# Altium schematic sheet 1_P1.schdoc
size 309 x 223 mm; Symbol: Sheet-Symbol_A4; Device: Sheet-Symbol_A4; Company: 嘉立创EDA; Version: V1.0; Page Size: A4; @Project Name: Ospyek ST7305 Display Driver Board; @Page Count: 1; @Update Date: 2025-10-29; @Create Date: 2025-10-27; @Schematic Name: Schematic1; @Page No: 1; @Page Name: P1; Title Block Position: 3; Width: 1170; Height: 825; Region Start: 1; X Region Count: 6; Y Region Count: 4; Blade Width: 10; @Board Name: Board1; @Create Time: 21:07:09; @Update Time: 23:08:17
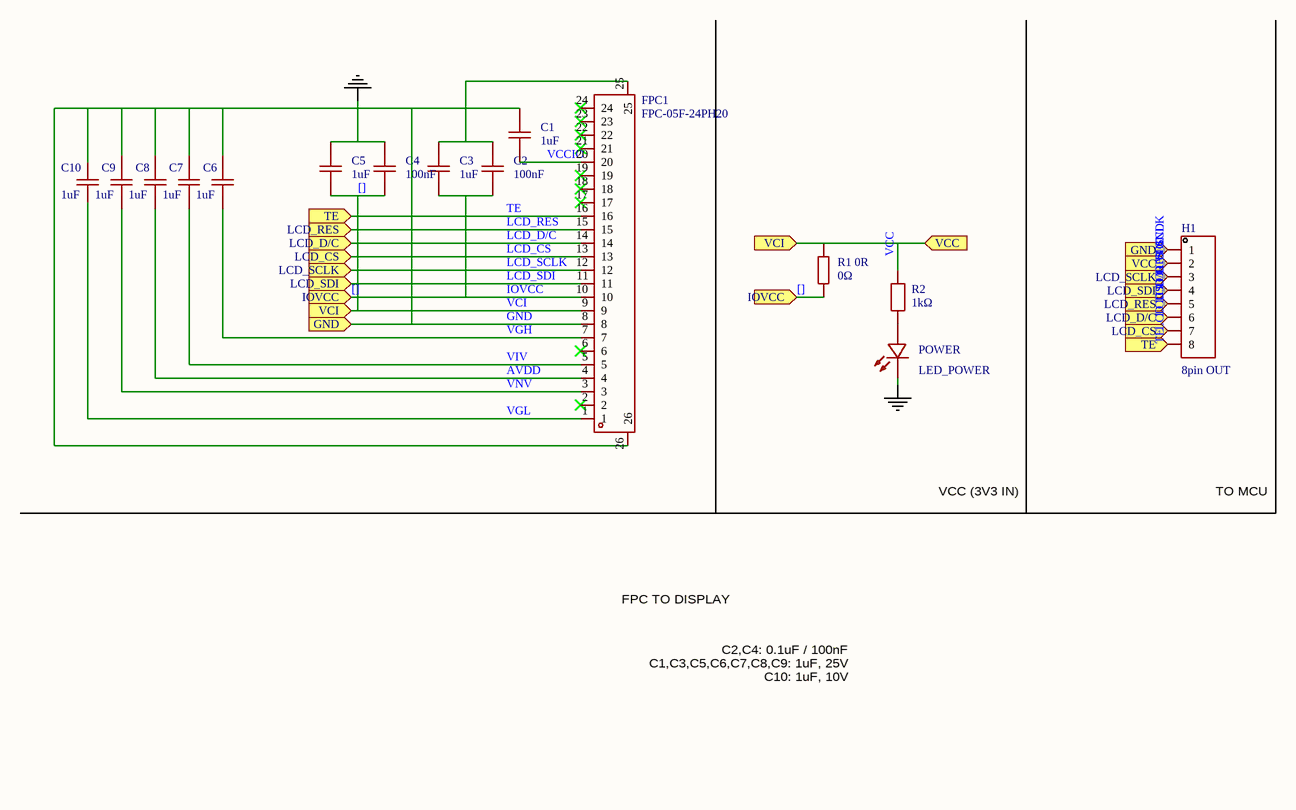
[diagram p0: 1_P1.schdoc]

## Parts
C1  1uF  [C0402]  (value not drawn)
C2  100nF  [C0402]  (value not drawn)
C3  1uF  [C0402]  (value not drawn)
C4  100nF  [C0402]  (value not drawn)
C5  1uF  [C0402]  (value not drawn)
C6  1uF  [C0402]  (value not drawn)
C7  1uF  [C0402]  (value not drawn)
C8  1uF  [C0402]  (value not drawn)
C9  1uF  [C0402]  (value not drawn)
C10  1uF  [C0402]  (value not drawn)
FPC1  FPC-05F-24PH20  [FPC-SMD_24P-P0.50_FPC-05F-24PH20]  (value not drawn)
H1  8pin OUT  [HDR-TH_8P-P2.54-V-M]  (value not drawn)
POWER  LED_POWER  [LED0603-RD-YELLOW]  (value not drawn)
R1_0R  0Ω  [R0805]  (value not drawn)
R2  1kΩ  [R0805]  (value not drawn)

## Ports
GND (in), IOVCC (in), LCD_CS (in), LCD_D/C (in), LCD_RES (in), LCD_SCLK (in), LCD_SDI (in), TE (in), VCC (in), VCI (in)

## Nets
GND: C1.2 C2.1 C3.1 C4.1 C5.1 C6.1 C7.1 C8.1 C9.1 C10.1 FPC1.8 FPC1.25 FPC1.26 H1.1 POWER.1(-) ; port GND
[]: C2.2 C3.2 C4.2 C5.2 FPC1.9 FPC1.10 H1.2 R1_0R.1 R1_0R.2 R2.2 ; port IOVCC, port VCC, port VCI  [also labelled IOVCC, VCC, VCI]
AVDD: C8.2 FPC1.4
LCD_CS: FPC1.13 H1.7 ; port LCD_CS
LCD_D/C: FPC1.14 H1.6 ; port LCD_D/C
LCD_RES: FPC1.15 H1.5 ; port LCD_RES
LCD_SCLK: FPC1.12 H1.3 ; port LCD_SCLK
LCD_SDI: FPC1.11 H1.4 ; port LCD_SDI
TE: FPC1.16 H1.8 ; port TE
VCCIO: C1.1 FPC1.20
VGH: C6.2 FPC1.7
VGL: C10.2 FPC1.1
VIV: C7.2 FPC1.5
VNV: C9.2 FPC1.3
NetPOWER_2: POWER.2(+) R2.1

Not connected (* = marked no-connect by the designer): FPC1 2* 6* 17* 18* 19* 21* 22* 23* 24*

## Notes on the sheet
- VCC (3V3 IN)
- TO MCU
- FPC TO DISPLAY
- C2,C4: 0.1uF / 100nF
  C1,C3,C5,C6,C7,C8,C9: 1uF, 25V
  C10: 1uF, 10V
- 1
- 2
- 3
- 4
- 5
- 6
- A
- B
- C
- 原理图
- Schematic1
- 创建日期
- 更新日期
- 2025-10-29
- 2025-10-27
- D
- 审阅
- 绘制
- 图页
- P1
- 物料编码
- Ospyek ST7305 Display Driver Board
- 版本
- 尺寸
- 页
- 共
- V1.0
- A4
- 嘉立创EDA

## Library data of the parts
C1 C3 C5-C9 = CL05A105KA5NQNC: 容值:1uF;精度:±10%;额定电压:25V;温度系数:X5R;; Manufacturer: SAMSUNG(三星); Add into BOM: yes; Tolerance: ±10%; Voltage Rating: 25V; Temperature Coefficient: X5R; Symbol: CL05A105KA5NQNC; Device: CL05A105KA5NQNC; LCSC Part Name: 1uF ±10% 25V; Supplier Part: C52923; Manufacturer Part: CL05A105KA5NQNC; Supplier Footprint: 0402; JLCPCB Part Class: 基础库; Datasheet: https://item.szlcsc.com/datasheet/CL05A105KA5NQNC/53938.html; Supplier: LCSC; Convert to PCB: yes; Value: 1uF
C2 C4 = CL05B104KB54PNC: 容值:100nF;精度:±10%;额定电压:50V;温度系数:X7R;; Manufacturer: SAMSUNG(三星); Add into BOM: yes; Tolerance: ±10%; Voltage Rating: 50V; Temperature Coefficient: X7R; Symbol: CL05B104KB54PNC; Device: CL05B104KB54PNC; LCSC Part Name: 100nF ±10% 50V; Supplier Part: C307331; Manufacturer Part: CL05B104KB54PNC; Supplier Footprint: 0402; JLCPCB Part Class: 基础库; Datasheet: https://item.szlcsc.com/datasheet/CL05B104KB54PNC/291005.html; Supplier: LCSC; Convert to PCB: yes; Value: 100nF
C10 = CL05A105KP5NNNC: 容值:1uF;精度:±10%;额定电压:10V;温度系数:X5R;; Manufacturer: SAMSUNG(三星); Add into BOM: yes; Tolerance: ±10%; Voltage Rating: 10V; Temperature Coefficient: X5R; Symbol: CL05A105KP5NNNC; Device: CL05A105KP5NNNC; LCSC Part Name: 1uF ±10% 10V; Supplier Part: C14445; Manufacturer Part: CL05A105KP5NNNC; Supplier Footprint: 0402; JLCPCB Part Class: 扩展库; Datasheet: https://item.szlcsc.com/datasheet/CL05A105KP5NNNC/15107.html; Supplier: LCSC; Convert to PCB: yes; Value: 1uF
FPC1 = FPC-05F-24PH20: 锁定特性:翻盖式;触点类型:卧贴;触点数量:24P;间距:0.5mm;安装方式:下接;工作温度:-25℃~+85℃;; Manufacturer: XUNPU(讯普); Add into BOM: yes; Locking Feature: 翻盖式; Number of Contacts: 24P; Pitch: 0.5mm; FFC, FCB Thickness: 0.3mm; Rated Voltage (Max): 50V; Current Rating (Max): 500mA; Symbol: FPC-05F-24PH20; Device: FPC-05F-24PH20; LCSC Part Name: 翻盖式 卧贴 P数:24P 间距:0.5mm; Supplier Part: C2856805; Manufacturer Part: FPC-05F-24PH20; Supplier Footprint: SMD,P=0.5mm,卧贴; JLCPCB Part Class: 扩展库; Datasheet: https://item.szlcsc.com/datasheet/FPC-05F-24PH20/3056903.html; Supplier: LCSC; Convert to PCB: yes; Contact Type: 卧贴; Mounting Type: 下接; Height Above Board: 2mm; Contact Material: 磷青铜; Contact Plating: 锡; Operating Temperature: -25℃~+85℃
H1 = B-2100S08P-A110: 插针结构:1x8P;间距:2.54mm;行距:-;圆针/方针:-;安装方式:直插;排数:单排;总PIN位数:8P;额定电流:-;额定电压:-;配合针长度:6mm;塑高:2.54mm;端接针长度:3mm;触头材质:黄铜;触头镀层:-;工作温度:-40℃~+105℃;颜色:黑色;; Manufacturer: Ckmtw(灿科盟); Symbol: Header-Male-2.54_1x8; Add into BOM: yes; Pin Structure: 1x8P; Pitch: 2.54mm; Device: B-2100S08P-A110; LCSC Part Name: 1x8P 间距:2.54mm 直插; Supplier Part: C124381; Manufacturer Part: 8pin OUT; Supplier Footprint: 插件,P=2.54mm; JLCPCB Part Class: 扩展库; Datasheet: https://item.szlcsc.com/datasheet/B-2100S08P-A110/125656.html; Supplier: LCSC; Convert to PCB: yes; Row Spacing: -; Circluar Pins/Square Pins: -; Mounting Type: 直插; Number of Rows: 单排; Number of Pins: 8P; Current Rating: -; Voltage Rating (Max): -; Length of Mating Pin: 6mm; Insulation Height: 2.54mm; Length of End Connection Pin: 3mm; Contact Material: 黄铜; Contact Plating: -; Operating Temperature: -40℃~+105℃; Color: 黑色
POWER = LTST-C191KSKT: 发光颜色:黄色;正向压降(Vf):2.1V;功率:75mW;正向电流:20mA;波长:584.5nm~597nm;二极管配置:-;透镜颜色:无色透明透镜;色温:-;发光强度:104mcd;发光角度:130°;载带方式:-;工作温度:-55℃~+85℃;; Manufacturer: LITEON(光宝); Add into BOM: yes; Illumination Color: 黄色; Voltage - Forward(Vf): 2.1V; Power(Watts): 75mW; Forward Current: 20mA; Peak Wavelength: 588nm; Lens Color: 无色透明透镜; Luminous Intensity: 104mcd; Viewing Angle: 130°; Symbol: LTST-C191KSKT; Device: LTST-C191KSKT; LCSC Part Name: 黄灯; Supplier Part: C125100; Manufacturer Part: LED_POWER; Supplier Footprint: 0603; JLCPCB Part Class: 扩展库; Datasheet: https://item.szlcsc.com/datasheet/LTST-C191KSKT/136376.html; Supplier: LCSC; Convert to PCB: yes; Wavelength - Dominant: 584.5nm~597nm; Diode Configuration: -; Color Temperature: -; Mounting Style: -; Operating Temperature: -55℃~+85℃
R1_0R = 0805W8F0000T5E: 电阻类型:厚膜电阻;阻值:0Ω;精度:±1%;功率:125mW;工作电压:150V;温度系数:±800ppm/℃;; Manufacturer: UNI-ROYAL(厚声); Add into BOM: yes; Tolerance: ±1%; Power(Watts): 125mW; Voltage-Supply(Max): 150V; Symbol: 0805W8F0000T5E; Device: 0805W8F0000T5E; LCSC Part Name: 0Ω ±1% 125mW 厚膜电阻; Supplier Part: C17477; Manufacturer Part: 0805W8F0000T5E; Supplier Footprint: 0805; JLCPCB Part Class: 基础库; Datasheet: https://item.szlcsc.com/datasheet/0805W8F0000T5E/18165.html; Supplier: LCSC; Convert to PCB: yes; Type: 厚膜电阻; Value: 0Ω; Temperature Coefficient: ±800ppm/℃; Operating Temperature: -55℃~+155℃
R2 = FRR0805J102 TS: 电阻类型:厚膜电阻;阻值:1kΩ;精度:±5%;功率:125mW;工作电压:150V;温度系数:±100ppm/℃;; Manufacturer: FOJAN(富捷); Add into BOM: yes; Tolerance: ±5%; Power(Watts): 125mW; Voltage-Supply(Max): 150V; Symbol: FRR0805J102 TS; Device: FRR0805J102 TS; LCSC Part Name: 厚膜电阻 0805 1KΩ ±5% 125mW; Supplier Part: C49196827; Manufacturer Part: FRR0805J102 TS; Supplier Footprint: 0805; JLCPCB Part Class: 扩展库; Datasheet: https://item.szlcsc.com/datasheet/FRR0805J102%2520TS/51599075.html; Supplier: LCSC; Convert to PCB: yes; Type: 厚膜电阻; Value: 1kΩ; Temperature Coefficient: ±100ppm/℃; Operating Temperature: -55℃~+155℃